# EAGLE schematic Diagram (EAGLE 9.6.2)
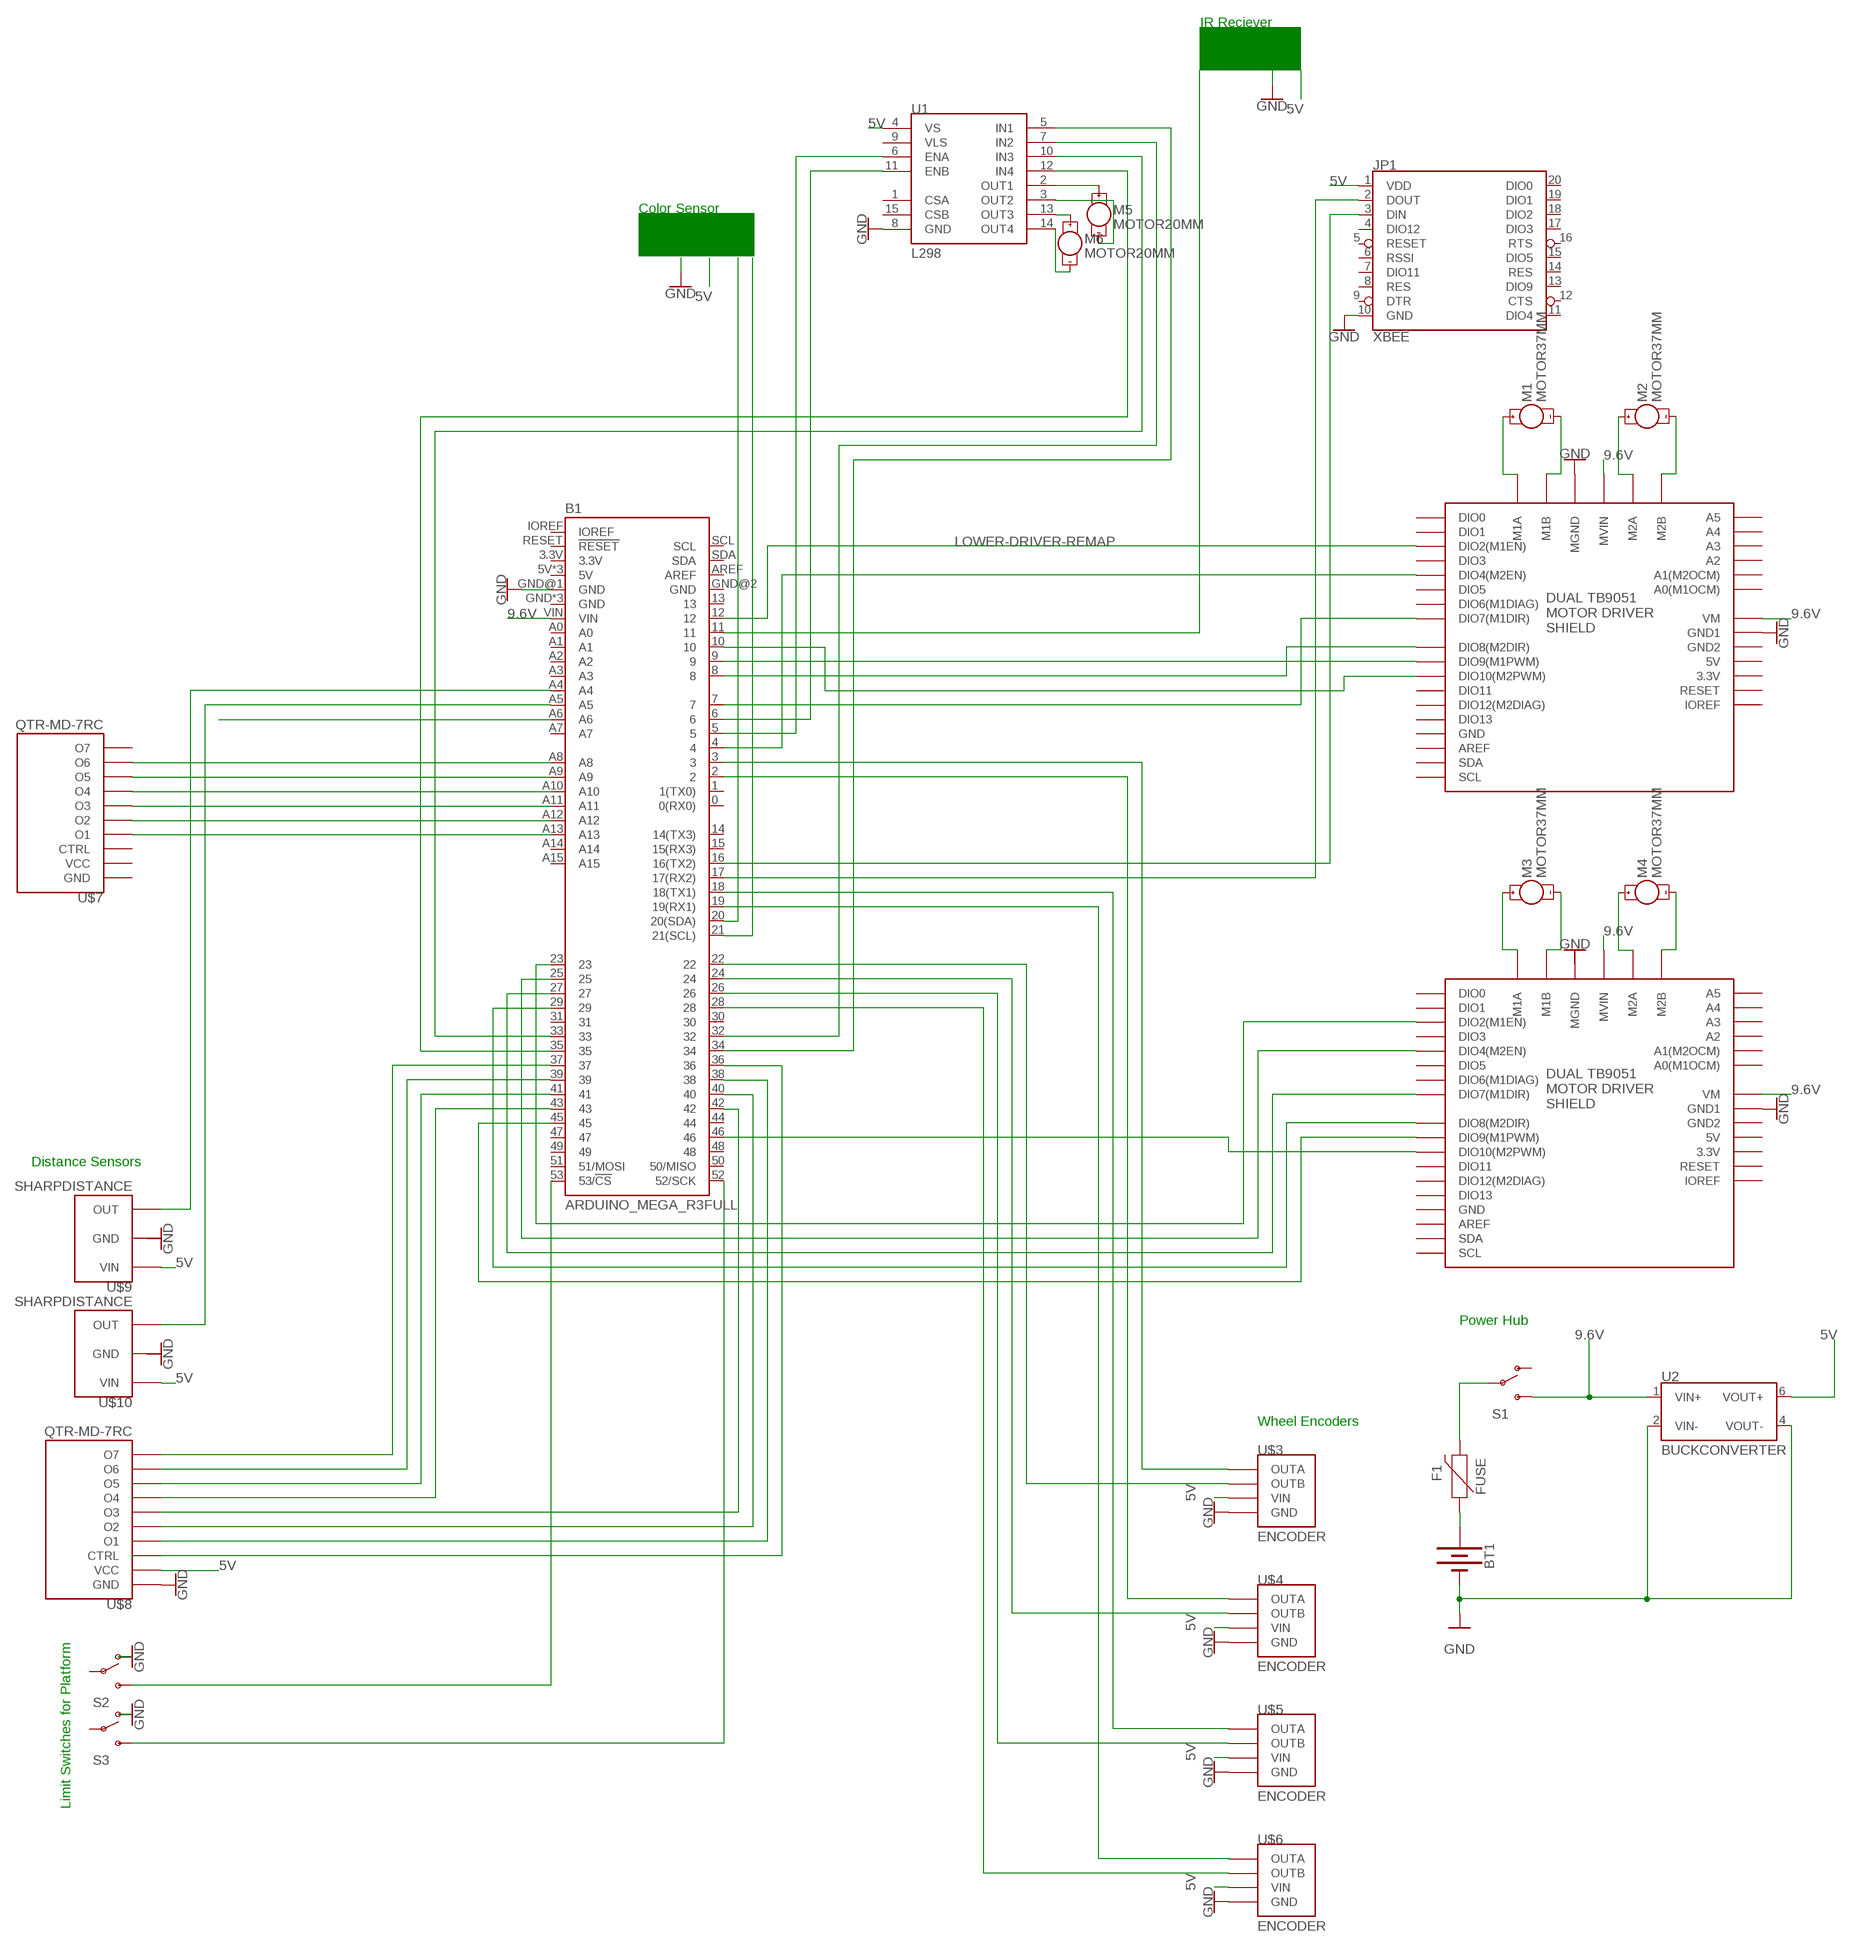
[diagram p0: schematic, sheet 1]

## Parts
B1  ARDUINO_MEGA_R3FULL  [ARDUINO_MEGA_NO_SILK]
BT1  BATTERY  [BATTCON_9V]
F1  FUSE  [FUSEFOOTPRINT]
JP1  XBEE  [XBEE]
M1  MOTOR37MM  MOTOR10MM  [VIBE-MOTOR-10MM]
M2  MOTOR37MM  MOTOR10MM  [VIBE-MOTOR-10MM]
M3  MOTOR37MM  MOTOR10MM  [VIBE-MOTOR-10MM]
M4  MOTOR37MM  MOTOR10MM  [VIBE-MOTOR-10MM]
M5  MOTOR20MM  MOTOR10MM  [VIBE-MOTOR-10MM]
M6  MOTOR20MM  MOTOR10MM  [VIBE-MOTOR-10MM]
S1  SWITCH-SPDTSMD  [SWITCH_SPDT_SMD]
S2  SWITCH-SPDTSMD  [SWITCH_SPDT_SMD]
S3  SWITCH-SPDTSMD  [SWITCH_SPDT_SMD]
U1  L298  [L298]
U2  BUCKCONVERTER  [BUCK]
U$1  DUALTB9051MOTORDRIVERSHIELD  [DUALTB9051SHIELD]
U$2  DUALTB9051MOTORDRIVERSHIELD  [DUALTB9051SHIELD]
U$3  ENCODER  [ENCODER]
U$4  ENCODER  [ENCODER]
U$5  ENCODER  [ENCODER]
U$6  ENCODER  [ENCODER]
U$7  QTR-MD-7RC  [QTRMD7]
U$8  QTR-MD-7RC  [QTRMD7]
U$9  SHARPDISTANCE  [SHARPDISTANCE]
U$10  SHARPDISTANCE  [SHARPDISTANCE]

## Nets
5V: JP1.1(VDD) U1.4(VS) U2.6(VOUT+) U$3.P$4(VIN) U$4.P$4(VIN) U$5.P$4(VIN) U$6.P$4(VIN) U$8.P$17(VCC) U$9.P$3(VIN) U$10.P$3(VIN)
9.6V: B1.VIN S1.3(S) U2.1(VIN+) U$1.P$33(MVIN) U$1.P$37(VM) U$2.P$33(MVIN) U$2.P$37(VM)
GND: B1.GND@1(GND) BT1.- JP1.10(GND) S2.1(O) S3.1(O) U1.8(GND) U2.2(VIN-) U2.4(VOUT-) U$1.P$25(GND1) U$1.P$32(MGND) U$2.P$25(GND1) U$3.P$1(GND) U$4.P$1(GND) U$5.P$1(GND) U$6.P$1(GND) U$8.P$2(GND)
LOWER-DRIVER-REMAP: B1.12 U$1.P$12(DIO2(M1EN))
N$1: BT1.+ F1.1
N$2: F1.2 S1.2(P)
N$3: M1.+ U$1.P$28(M1A)
N$4: M1.- U$1.P$29(M1B)
N$5: M2.+ U$1.P$30(M2A)
N$6: M2.- U$1.P$31(M2B)
N$7: M3.+ U$2.P$28(M1A)
N$8: M3.- U$2.P$29(M1B)
N$9: M4.+ U$2.P$30(M2A)
N$10: M4.- U$2.P$31(M2B)
N$11: M6.+ U1.13(OUT3)
N$12: M6.- U1.14(OUT4)
N$13: M5.- U1.3(OUT2)
N$14: M5.+ U1.2(OUT1)
N$15: B1.20(20(SDA))
N$16: B1.4 U$1.P$14(DIO4(M2EN))
N$17: B1.25 U$2.P$14(DIO4(M2EN))
N$18: B1.23 U$2.P$12(DIO2(M1EN))
N$19: B1.7 U$1.P$17(DIO7(M1DIR))
N$20: B1.8 U$1.P$18(DIO8(M2DIR))
N$21: B1.27 U$2.P$17(DIO7(M1DIR))
N$22: B1.29 U$2.P$18(DIO8(M2DIR))
N$23: B1.9 U$1.P$19(DIO9(M1PWM))
N$24: B1.16(16(TX2)) JP1.3(DIN)
N$25: B1.45 U$2.P$19(DIO9(M1PWM))
N$26: B1.46 U$2.P$20(DIO10(M2PWM))
N$27: B1.10 U$1.P$20(DIO10(M2PWM))
N$28: B1.17(17(RX2)) JP1.2(DOUT)
N$29: B1.5 U1.6(ENA)
N$30: B1.6 U1.11(ENB)
N$31: B1.33 U1.10(IN3)
N$32: B1.32 U1.7(IN2)
N$33: B1.35 U1.12(IN4)
N$34: B1.34 U1.5(IN1)
N$35: B1.22 U$3.P$3(OUTB)
N$36: B1.24 U$4.P$3(OUTB)
N$37: B1.26 U$5.P$3(OUTB)
N$38: B1.28 U$6.P$3(OUTB)
N$39: B1.3 U$3.P$2(OUTA)
N$40: B1.2 U$4.P$2(OUTA)
N$41: B1.18(18(TX1)) U$5.P$2(OUTA)
N$42: B1.19(19(RX1)) U$6.P$2(OUTA)
N$43: B1.11
N$44: B1.21(21(SCL))
N$45: B1.53(53/!CS) S2.3(S)
N$46: B1.52(52/SCK) S3.3(S)
N$47: B1.37 U$8.P$16(O7)
N$48: B1.39 U$8.P$14(O6)
N$49: B1.41 U$8.P$11(O5)
N$50: B1.43 U$8.P$9(O4)
N$51: B1.42 U$8.P$7(O3)
N$52: B1.40 U$8.P$5(O2)
N$53: B1.38 U$8.P$3(O1)
N$54: B1.36 U$8.P$1(CTRL)
N$55: B1.A4 U$9.P$2(OUT)
N$56: B1.A5 U$10.P$2(OUT)
N$57: B1.A6
N$58: B1.A13 U$7.P$3(O1)
N$59: B1.A12 U$7.P$5(O2)
N$60: B1.A11 U$7.P$7(O3)
N$61: B1.A10 U$7.P$9(O4)
N$62: B1.A9 U$7.P$11(O5)
N$63: B1.A8 U$7.P$14(O6)
Unconnected: B1.0(0(RX0)) B1.1(1(TX0)) B1.3.3V B1.5V B1.5V@1(5V) B1.5V@2(5V) B1.13 B1.14(14(TX3)) B1.15(15(RX3)) B1.30 B1.31 B1.44 B1.47 B1.48 B1.49 B1.50(50/MISO) B1.51(51/MOSI) B1.A0 B1.A1 B1.A2 B1.A3 B1.A7 B1.A14 B1.A15 B1.AREF B1.GND B1.GND@2(GND) B1.GND@3(GND) B1.GND@4(GND) B1.IOREF B1.RESET(!RESET) B1.SCL B1.SDA JP1.4(DIO12) JP1.5(RESET) JP1.6(RSSI) JP1.7(DIO11) JP1.8(RES) JP1.9(DTR) JP1.11(DIO4) JP1.12(CTS) JP1.13(DIO9) JP1.14(RES) JP1.15(DIO5) JP1.16(RTS) JP1.17(DIO3) JP1.18(DIO2) JP1.19(DIO1) JP1.20(DIO0) S1.1(O) S2.2(P) S3.2(P) U1.1(CSA) U1.9(VLS) U1.15(CSB) U$1.P$1(3.3V) U$1.P$2(5V) U$1.P$3(A0(M1OCM)) U$1.P$4(A1(M2OCM)) U$1.P$5(A2) U$1.P$6(A3) U$1.P$7(A4) U$1.P$8(A5) U$1.P$9(AREF) U$1.P$10(DIO0) U$1.P$11(DIO1) U$1.P$13(DIO3) U$1.P$15(DIO5) U$1.P$16(DIO6(M1DIAG)) U$1.P$21(DIO11) U$1.P$22(DIO12(M2DIAG)) U$1.P$23(DIO13) U$1.P$24(GND) U$1.P$26(GND2) U$1.P$27(IOREF) U$1.P$34(RESET) U$1.P$35(SCL) U$1.P$36(SDA) U$2.P$1(3.3V) U$2.P$2(5V) U$2.P$3(A0(M1OCM)) U$2.P$4(A1(M2OCM)) U$2.P$5(A2) U$2.P$6(A3) U$2.P$7(A4) U$2.P$8(A5) U$2.P$9(AREF) U$2.P$10(DIO0) U$2.P$11(DIO1) U$2.P$13(DIO3) U$2.P$15(DIO5) U$2.P$16(DIO6(M1DIAG)) U$2.P$21(DIO11) U$2.P$22(DIO12(M2DIAG)) U$2.P$23(DIO13) U$2.P$24(GND) U$2.P$26(GND2) U$2.P$27(IOREF) U$2.P$32(MGND) U$2.P$34(RESET) U$2.P$35(SCL) U$2.P$36(SDA) U$7.P$1(CTRL) U$7.P$2(GND) U$7.P$16(O7) U$7.P$17(VCC) U$9.P$1(GND) U$10.P$1(GND)

## Notes on the sheet
- IR Reciever
- Color Sensor
- Distance Sensors
- Power Hub
- Wheel Encoders
- Limit Switches for Platform

## Library data of the parts
B1 = ElectricalDiagramLibrary:ARDUINO_MEGA_R3: Arduino Mega R3 ATmega2560 R3 compatible footprint. SparkFun Products: Arduino Mega 2560 R3 <https://www.sparkfun.com/products/11061>
BT1 = ElectricalDiagramLibrary:BATTERY: Battery - Single Cell A variety of battery chemistries, sizes, and footprints. Device List: 20MM_PTH - Coin Cell Battery Holder - 20mm (PTH) <https://www.sparkfun.com/products/783> 20MM_PTH_KIT- Coin Cell battery Holder - 20 mm (PTH) <http://www.sparkfun.com/products/783>kit version with special mask 6.8MM_PTH - Coin Cell Battery Holder - 6.8MM(SMD) <https://www.digikey.com/product-detail/en/seiko-instruments/MS621FE-FL11E/728-1057-ND/1889208?WT.srch=1&gclid=CNOQ5a6LzdQCFZS2wAodXCkE0g> 12MM_SMD - Coin Cell Battery Holder - 12mm (SMD) <https://www.sparkfun.com/products/10592> 12MM_PTH - Coin Cell Battery Holder - 12mm (PTH) <https://www.sparkfun.com/products/7948> 20MM_SMD - 20mm Coin Cell Battery Holder (SMD) (2 legs) Used on the Big Time Watch Kit <https://www.sparkfun.com/products/11734> 20MM_SMD_4LEGS - Coin Cell Battery Holder - 20mm (SMD) <https://www.sparkfun.com/products/11892> 20MM_SMD_4LEGS_OVERPASTE - Coin Cell Battery Holder - 20mm (SMD) <https://www.sparkfun.com/products/11892> (Over-paste on the legs) 24.5MM_PTH - Coin Cell Battery Holder - 24.5mm (PTH) <https://www.sparkfun.com/products/8863> 9V - 9V Battery Holder - PC Mount Used on the SparkFun SparkPunk Sound Kit <https://www.sparkfun.com/products/11177> and SparkFun SparkPunk Sequencer Kit <https://www.sparkfun.com/products/12707> 18650 - Battery Holder - 18650 (PTH) <https://www.sparkfun.com/products/13113> AA - Battery Holder - 1xAA (PTH) <https://www.sparkfun.com/products/7949> AAA - Battery Holder - 1xAAA (PTH) <https://www.sparkfun.com/products/12718> AA_KIT - Battery Holder - 1xAA (PTH) <https://www.sparkfun.com/products/7949> Special kit package - pads only have exposed copper on one side of the board. AAA_KIT - Battery Holder - 1xAAA (PTH) <https://www.sparkfun.com/products/12718> Special kit package - pads only have exposed copper on one side of the board.
F1 = ElectricalDiagramLibrary:FUSE: Resettable Fuse PPTC Resettable Fuse. Really a sort of resistor with a polymeric positive temperature coefficient whose resistance increases dramatically with an increase in temperature. When heated by the power passing through the resistance rises causing the current to be limited, protecting the circuit. This is achieved by the transition of the polymer from a crystalline to an amorphous state where the conductive carbon separates breaking the conductive pathways found in the cool crystalline structure. When a PPTC cools back down it resumes conducting letting the circuit turn back on. SparkFun Products: SparkFun RedBoard - Programmed with Arduino <https://www.sparkfun.com/products/12757> Pro Micro - 5V/16MHz <https://www.sparkfun.com/products/12640> Arduino Pro 328 - 5V/16MHz <https://www.sparkfun.com/products/10915> MP3 Trigger <https://www.sparkfun.com/products/13720>
JP1 = ElectricalDiagramLibrary:XBEE: Digi XBee and XBee Pro XBees are tiny blue chips that can communicate wirelessly with each other. They can do simple things, like replacing a couple of wires in serial communication, which is nice when you want to make a remote for your paintball vehicle. SparkFun Products SparkFun XBee Buying Guide <https://www.sparkfun.com/pages/xbee_guide> SparkFun XBee Explorer USB <https://www.sparkfun.com/products/11812> (WRL-11812) Breakout Board for XBee Module <https://www.sparkfun.com/products/8276> (WRL-8276) SparkFun XBee Explorer Regulated <https://www.sparkfun.com/products/11373> (WRL-11373) SparkFun XBee Explorer Dongle <https://www.sparkfun.com/products/11697> (WRL-11697) SparkFun XBee Shield <https://www.sparkfun.com/products/12847> (WRL-12847) SparkFun XBee Explorer Serial <https://www.sparkfun.com/products/13225> (WRL-13225)
M1-M6 = ElectricalDiagramLibrary:MOTOR: Motor (Single-Phase) Two-terminal, single-phase motors. SparkFun Products Vibration Motor <https://www.sparkfun.com/products/8449> (ROB-08449) Physical dimension and wire connections for this powerful vibration motor. Motor has a self adhesive backing.; PROD_ID: COMP-08572; SF_SKU: ROB-08449; SPICEPREFIX: B
S1-S3 = ElectricalDiagramLibrary:SWITCH-SPDT: SPDT Switch Simple slide switch, Spark Fun Electronics SKU : COM-00102 DPDT SMT slide switch, AYZ0202, SWCH-08179
U1 = ElectricalDiagramLibrary:L298: L298 Dual Full Bridge Driver
U2 = ElectricalDiagramLibrary:BUCKCONVERTER: Recom Power RFB-0505S 1W DC/DC Converter This 1W DC/DC converter keeps two power supplies magnetically isolated. Supplies up to 200 mA @ 5V.; PROD_ID: IC-14143
U$1 U$2 = ElectricalDiagramLibrary:DUALTB9051MOTORDRIVERSHIELD: Dual TB9051 Motor Driver Shield for Arduino.
U$3-U$6 = ElectricalDiagramLibrary:ENCODER: Dual Channel Encoder
U$7 U$8 = ElectricalDiagramLibrary:QTR-MD-7RC: QTR-MD-7RC Reflectance Sensor Array
U$9 U$10 = ElectricalDiagramLibrary:SHARPDISTANCE: Sharp Distance Sensor

## Module SENSING
Ports: 

### Library data of the parts